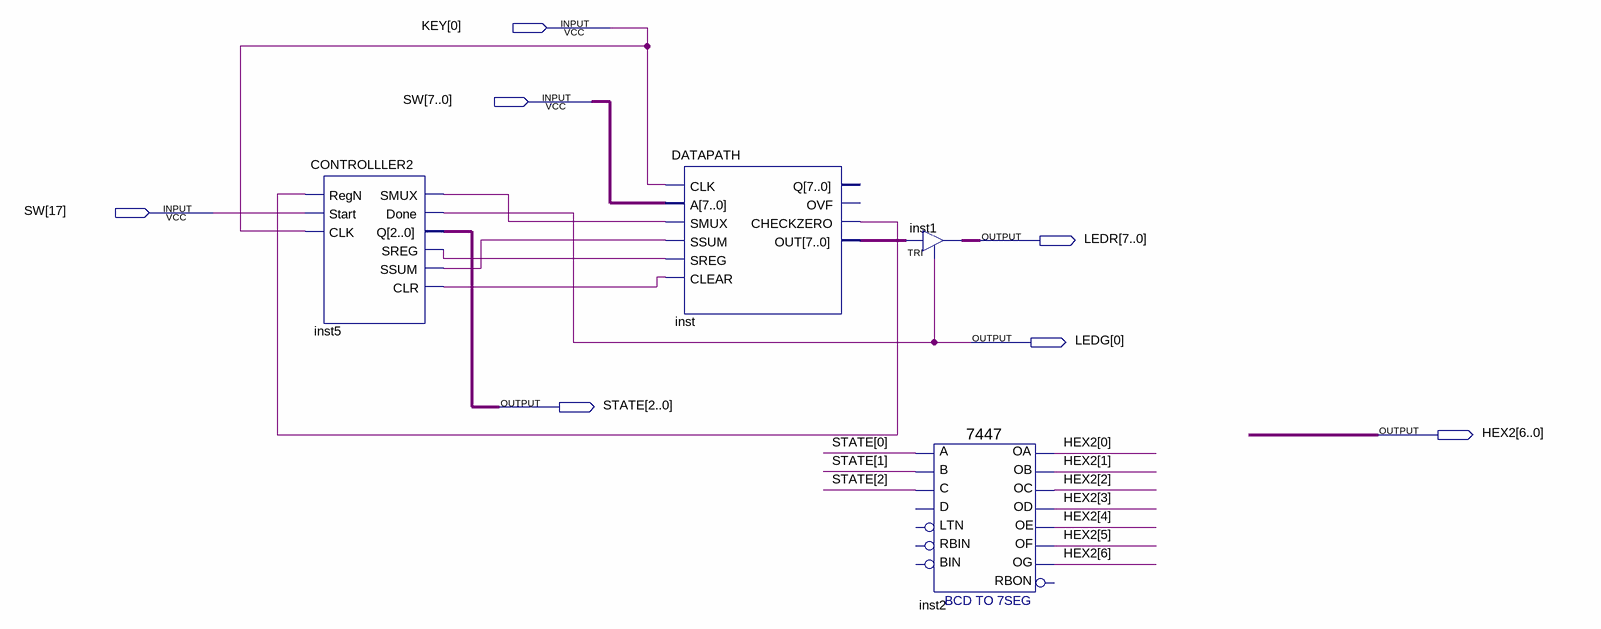
[diagram p0: schematic sheet]
// Quartus schematic DISPLAY.bdf as structural Verilog: 4 symbols, 7 pins
module DISPLAY (
  input  [0:0] KEY,
  input  [17:0] SW,
  output [7:0] LEDR,
  output [0:0] LEDG,
  output [2:0] STATE,
  output [6:0] HEX2
);

  wire inst5_clr, inst5_smux, inst5_sreg, inst5_ssum, inst_checkzero;
  wire [7:0] inst_out;

  CONTROLLLER2 inst5 (
    .RegN(inst_checkzero), .Start(SW[17]), .CLK(KEY[0]), .SMUX(inst5_smux), .Done(LEDG[0]), .Q(STATE),
    .SREG(inst5_sreg), .SSUM(inst5_ssum), .CLR(inst5_clr));
  DATAPATH inst (
    .CLK(KEY[0]), .A(SW[7:0]), .SMUX(inst5_smux), .SSUM(inst5_ssum), .SREG(inst5_sreg), .CLEAR(inst5_clr),
    .CHECKZERO(inst_checkzero), .OUT(inst_out));  // open: Q, OVF
  TRI inst1[7:0] (.IN(inst_out), .OE(LEDG[0]), .OUT(LEDR));
  \7447  inst2 (
    .B(STATE[1]), .C(STATE[2]), .A(STATE[0]), .OB(HEX2[1]), .OC(HEX2[2]), .OE(HEX2[4]), .OD(HEX2[3]),
    .OF(HEX2[5]), .OG(HEX2[6]), .OA(HEX2[0]));  // open: LTN, D, RBIN, BIN, RBON
endmodule
